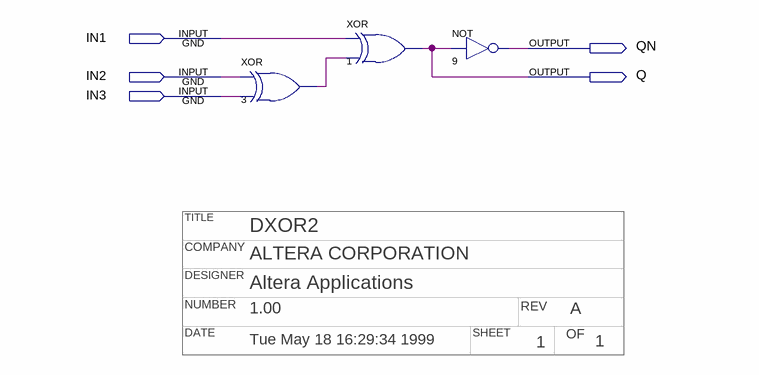
[diagram p0: schematic sheet]
// Quartus schematic dxor3.bdf as structural Verilog: 3 symbols, 5 pins
// Title block: TITLE: DXOR2; COMPANY: ALTERA CORPORATION; DESIGNER: Altera Applications; NUMBER: 1.00; REV: A; DATE: Tue May 18 16:29:34 1999; SHEET: 1; OF: 1
module dxor3 (
  input  IN1,
  input  IN2,
  input  IN3,
  output QN,
  output Q
);

  wire n3_out;

  xor u_3 (n3_out, IN2, IN3);
  xor u_1 (Q, IN1, n3_out);
  not u_9 (QN, Q);
endmodule
